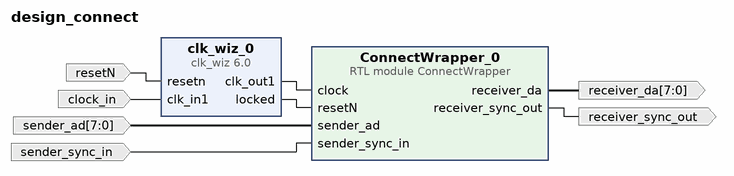
[diagram p0: block diagram of the top level]
# Vivado block design design_connect, xc7z020clg400-2, Vivado 2018.3
create_bd_design design_connect

create_bd_port -dir I -type clk clock_in
set_property -dict {CONFIG.FREQ_HZ 50000000} [get_bd_ports clock_in]
create_bd_port -dir I -type rst resetN
create_bd_port -dir I -from 7 -to 0 -type data sender_ad
create_bd_port -dir I sender_sync_in
create_bd_port -dir O -from 7 -to 0 -type data receiver_da
create_bd_port -dir O receiver_sync_out

create_bd_cell -type ip -vlnv xilinx.com:ip:clk_wiz:6.0 clk_wiz_0
set_property -dict [list \
  CONFIG.CLKOUT1_JITTER 156.886 \
  CONFIG.CLKOUT1_PHASE_ERROR 160.484 \
  CONFIG.CLKOUT1_REQUESTED_OUT_FREQ 120.000 \
  CONFIG.MMCM_CLKFBOUT_MULT_F 19.500 \
  CONFIG.MMCM_CLKOUT0_DIVIDE_F 8.125 \
  CONFIG.MMCM_DIVCLK_DIVIDE 1 \
  CONFIG.RESET_PORT resetn \
  CONFIG.RESET_TYPE ACTIVE_LOW \
] [get_bd_cells clk_wiz_0]
create_bd_cell -type module -reference ConnectWrapper ConnectWrapper_0

# ---- connections ----

connect_bd_net [get_bd_ports resetN] [get_bd_pins clk_wiz_0/resetn]
connect_bd_net [get_bd_ports clock_in] [get_bd_pins clk_wiz_0/clk_in1]
connect_bd_net [get_bd_pins clk_wiz_0/clk_out1] [get_bd_pins ConnectWrapper_0/clock]
connect_bd_net [get_bd_pins clk_wiz_0/locked] [get_bd_pins ConnectWrapper_0/resetN]
connect_bd_net [get_bd_ports sender_ad] [get_bd_pins ConnectWrapper_0/sender_ad]
connect_bd_net [get_bd_ports sender_sync_in] [get_bd_pins ConnectWrapper_0/sender_sync_in]
connect_bd_net [get_bd_pins ConnectWrapper_0/receiver_da] [get_bd_ports receiver_da]
connect_bd_net [get_bd_pins ConnectWrapper_0/receiver_sync_out] [get_bd_ports receiver_sync_out]

validate_bd_design
save_bd_design
